# Altium schematic sheet STM32F103_开关量输入-TLP521.SchDoc
size A4; SheetNumber: 4; SheetTotal: 4
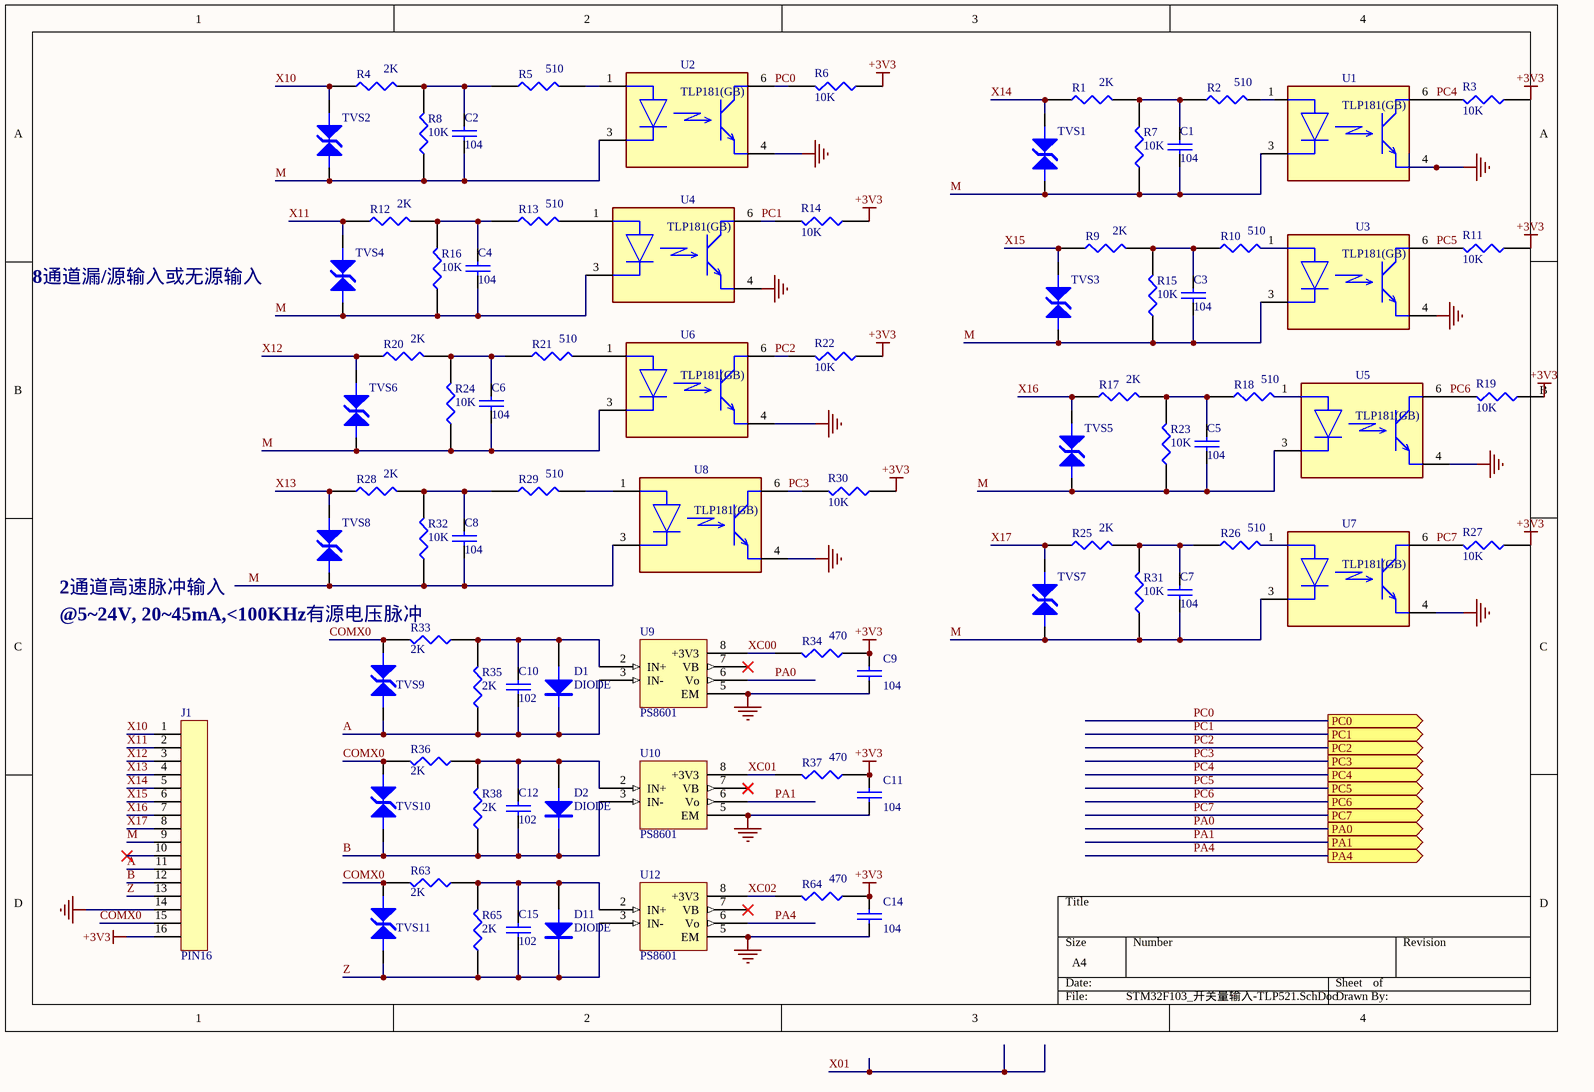
[diagram p0: STM32F103_开关量输入-TLP521.SchDoc]

## Parts
C1  104  [CAP[0603]]
C2  104  [CAP[0603]]
C3  104  [CAP[0603]]
C4  104  [CAP[0603]]
C5  104  [CAP[0603]]
C6  104  [CAP[0603]]
C7  104  [CAP[0603]]
C8  104  [CAP[0603]]
C9  104  [CAP[0603]]
C10  102  [CAP[0603]]
C11  104  [CAP[0603]]
C12  102  [CAP[0603]]
C14  104  [CAP[0603]]
C15  102  [CAP[0603]]
D1  DIODE  [SOD-123]
D2  DIODE  [SOD-123]
D11  DIODE  [SOD-123]
J1  PIN16  [KF128-5.08-16P]
R1  2K  [RES[0603]]
R2  510  [RES[0603]]
R3  10K  [RES[0603]]
R4  2K  [RES[0603]]
R5  510  [RES[0603]]
R6  10K  [RES[0603]]
R7  10K  [RES[0603]]
R8  10K  [RES[0603]]
R9  2K  [RES[0603]]
R10  510  [RES[0603]]
R11  10K  [RES[0603]]
R12  2K  [RES[0603]]
R13  510  [RES[0603]]
R14  10K  [RES[0603]]
R15  10K  [RES[0603]]
R16  10K  [RES[0603]]
R17  2K  [RES[0603]]
R18  510  [RES[0603]]
R19  10K  [RES[0603]]
R20  2K  [RES[0603]]
R21  510  [RES[0603]]
R22  10K  [RES[0603]]
R23  10K  [RES[0603]]
R24  10K  [RES[0603]]
R25  2K  [RES[0603]]
R26  510  [RES[0603]]
R27  10K  [RES[0603]]
R28  2K  [RES[0603]]
R29  510  [RES[0603]]
R30  10K  [RES[0603]]
R31  10K  [RES[0603]]
R32  10K  [RES[0603]]
R33  2K  [RES[0603]]
R34  470  [RES[0603]]
R35  2K  [RES[0603]]
R36  2K  [RES[0603]]
R37  470  [RES[0603]]
R38  2K  [RES[0603]]
R63  2K  [RES[0603]]
R64  470  [RES[0603]]
R65  2K  [RES[0603]]
TVS1  (no value)  [TVS]
TVS2  (no value)  [TVS]
TVS3  (no value)  [TVS]
TVS4  (no value)  [TVS]
TVS5  (no value)  [TVS]
TVS6  (no value)  [TVS]
TVS7  (no value)  [TVS]
TVS8  (no value)  [TVS]
TVS9  (no value)  [TVS]
TVS10  (no value)  [TVS]
TVS11  (no value)  [TVS]
U1  TLP181(GB)  [FP-11-4C1-MFG]
U2  TLP181(GB)  [FP-11-4C1-MFG]
U3  TLP181(GB)  [FP-11-4C1-MFG]
U4  TLP181(GB)  [FP-11-4C1-MFG]
U5  TLP181(GB)  [FP-11-4C1-MFG]
U6  TLP181(GB)  [FP-11-4C1-MFG]
U7  TLP181(GB)  [FP-11-4C1-MFG]
U8  TLP181(GB)  [FP-11-4C1-MFG]
U9  PS8601  [DIP8_8601]
U10  PS8601  [DIP8_8601]
U12  PS8601  [DIP8_8601]

## Ports
PA0 (out), PA1 (out), PA4 (out), PC0 (out), PC1 (out), PC2 (out), PC3 (out), PC4 (out), PC5 (out), PC6 (out), PC7 (out)

## Nets
+3V3: C9.1 C11.1 C14.1 J1.16 R3.1 R6.1 R11.1 R14.1 R19.1 R22.1 R27.1 R30.1 R34.1 R37.1 R64.1
GND: C9.2 C11.2 C14.2 J1.14 U1.4(E) U2.4(E) U3.4(E) U4.4(E) U5.4(E) U6.4(E) U7.4(E) U8.4(E) U9.5(EM) U10.5(EM) U12.5(EM)
NC: U9.1(NC) U9.4(NC) U10.1(NC) U10.4(NC) U12.1(NC) U12.4(NC)
A: C10.2 D1.2(K) J1.11 R35.1 TVS9.1(A) U9.3(IN-)
B: C12.2 D2.2(K) J1.12 R38.1 TVS10.1(A) U10.3(IN-)
COMX0: J1.15 R33.2 R36.2 R63.2 TVS9.2(K) TVS10.2(K) TVS11.2(K)
M: C1.2 C2.2 C3.2 C4.2 C5.2 C6.2 C7.2 C8.2 J1.9 R7.1 R8.1 R15.1 R16.1 R23.1 R24.1 R31.1 R32.1 TVS1.1(A) TVS2.1(A) TVS3.1(A) TVS4.1(A) TVS5.1(A) TVS6.1(A) TVS7.1(A) TVS8.1(A) U1.3(C) U2.3(C) U3.3(C) U4.3(C) U5.3(C) U6.3(C) U7.3(C) U8.3(C)
PA0: U9.6(Vo) ; port PA0
PA1: U10.6(Vo) ; port PA1
PA4: U12.6(Vo) ; port PA4
PC0: R6.2 U2.6(C) ; port PC0
PC1: R14.2 U4.6(C) ; port PC1
PC2: R22.2 U6.6(C) ; port PC2
PC3: R30.2 U8.6(C) ; port PC3
PC4: R3.2 U1.6(C) ; port PC4
PC5: R11.2 U3.6(C) ; port PC5
PC6: R19.2 U5.6(C) ; port PC6
PC7: R27.2 U7.6(C) ; port PC7
X10: J1.1 R4.1 TVS2.2(K)
X11: J1.2 R12.1 TVS4.2(K)
X12: J1.3 R20.1 TVS6.2(K)
X13: J1.4 R28.1 TVS8.2(K)
X14: J1.5 R1.1 TVS1.2(K)
X15: J1.6 R9.1 TVS3.2(K)
X16: J1.7 R17.1 TVS5.2(K)
X17: J1.8 R25.1 TVS7.2(K)
XC00: R34.2 U9.8(+3V3)
XC01: R37.2 U10.8(+3V3)
XC02: R64.2 U12.8(+3V3)
Z: C15.2 D11.2(K) J1.13 R65.1 TVS11.1(A) U12.3(IN-)
NetC1_1: C1.1 R1.2 R2.1 R7.2
NetC2_1: C2.1 R4.2 R5.1 R8.2
NetC3_1: C3.1 R9.2 R10.1 R15.2
NetC4_1: C4.1 R12.2 R13.1 R16.2
NetC5_1: C5.1 R17.2 R18.1 R23.2
NetC6_1: C6.1 R20.2 R21.1 R24.2
NetC7_1: C7.1 R25.2 R26.1 R31.2
NetC8_1: C8.1 R28.2 R29.1 R32.2
NetC10_1: C10.1 D1.1(A) R33.1 R35.2 U9.2(IN+)
NetC12_1: C12.1 D2.1(A) R36.1 R38.2 U10.2(IN+)
NetC15_1: C15.1 D11.1(A) R63.1 R65.2 U12.2(IN+)
NetR2_2: R2.2 U1.1(A)
NetR5_2: R5.2 U2.1(A)
NetR10_2: R10.2 U3.1(A)
NetR13_2: R13.2 U4.1(A)
NetR18_2: R18.2 U5.1(A)
NetR21_2: R21.2 U6.1(A)
NetR26_2: R26.2 U7.1(A)
NetR29_2: R29.2 U8.1(A)

Not connected (* = marked no-connect by the designer): J1 10*; U9 7(VB)*; U10 7(VB)*; U12 7(VB)*

## Notes on the sheet
- 8通道漏/源输入或无源输入
- 2通道高速脉冲输入
- @5~24V, 20~45mA,<100KHz有源电压脉冲

## Library data of the parts
C1-C12 C14 C15 = CAP: Capacitor
R1-R38 R63-R65 = RES1
TVS1-TVS11 = TVS
U1-U8 = CMP-35887-000008-1: OPTOCOUPLER TRANS 3.75KVRMS 6SO; Manufacturer: Toshiba; Collector Emitter Voltage: 80V; Min Current Transfer Ratio: 100%; Max Junction Temp: +125°C; Power Dissipation: 200mW; Max Current Transfer Ratio: 600%; Max Supply Voltage: 48V; Forward Voltage: 1.15V; Turn On Delay Time: 3us; Isolation Voltage: 3750Vrms; Reverse Voltage: 5V; Forward Current: 10mA; Emiiter Collector Voltage: 7V; Standoff Height: 0.1mm; Footprint Url: https://toshiba.semicon-storage.com/eu/design-support/package/detail.4pin%20MFSOP6.html; Device Class L3: unset; ComponentLink2Description: Datasheet; Device Class L1: Optoelectronics; Temperature: -55°C to +110°C; Temperature Range High: +110°C; Automotive: No; Octopart: https://octopart.com/tlp181gb-toshiba-8180795; ComponentLink2URL: https://toshiba.semicon-storage.com/info/docget.jsp?did=16749&prodName=TLP181; Category: Trans; Package: 11-4C1; Turn Off Delay Time: 3us; Temperature Range Low: -55°C; Device Class L2: Optocouplers; RoHS: TRUE; Lead Free: Yes; Ipc Land Pattern Name: SOP254P700X260-4; Manufacturer Part Number: TLP181(GB); Height: 2.8mm
U9 U10 U12 = PS8601: High speed optocoupler